# EasyEDA Pro project 视觉车.eprj, board 视觉车
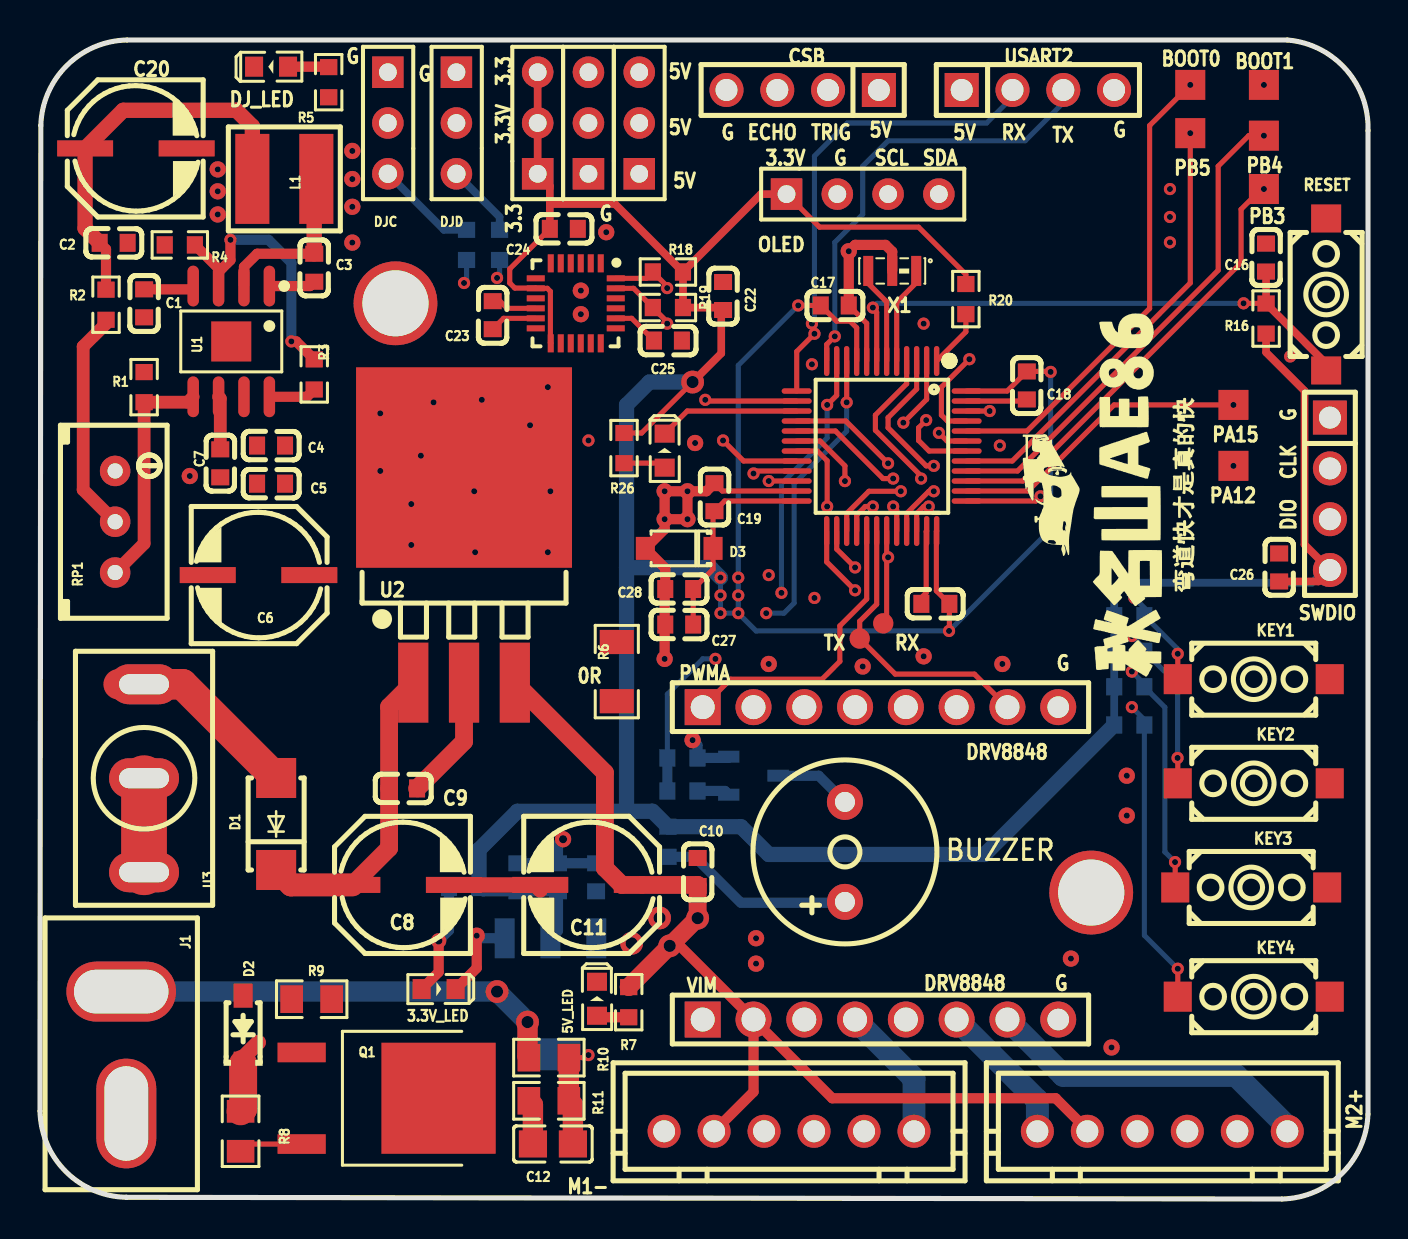
[diagram p1: board, top side]
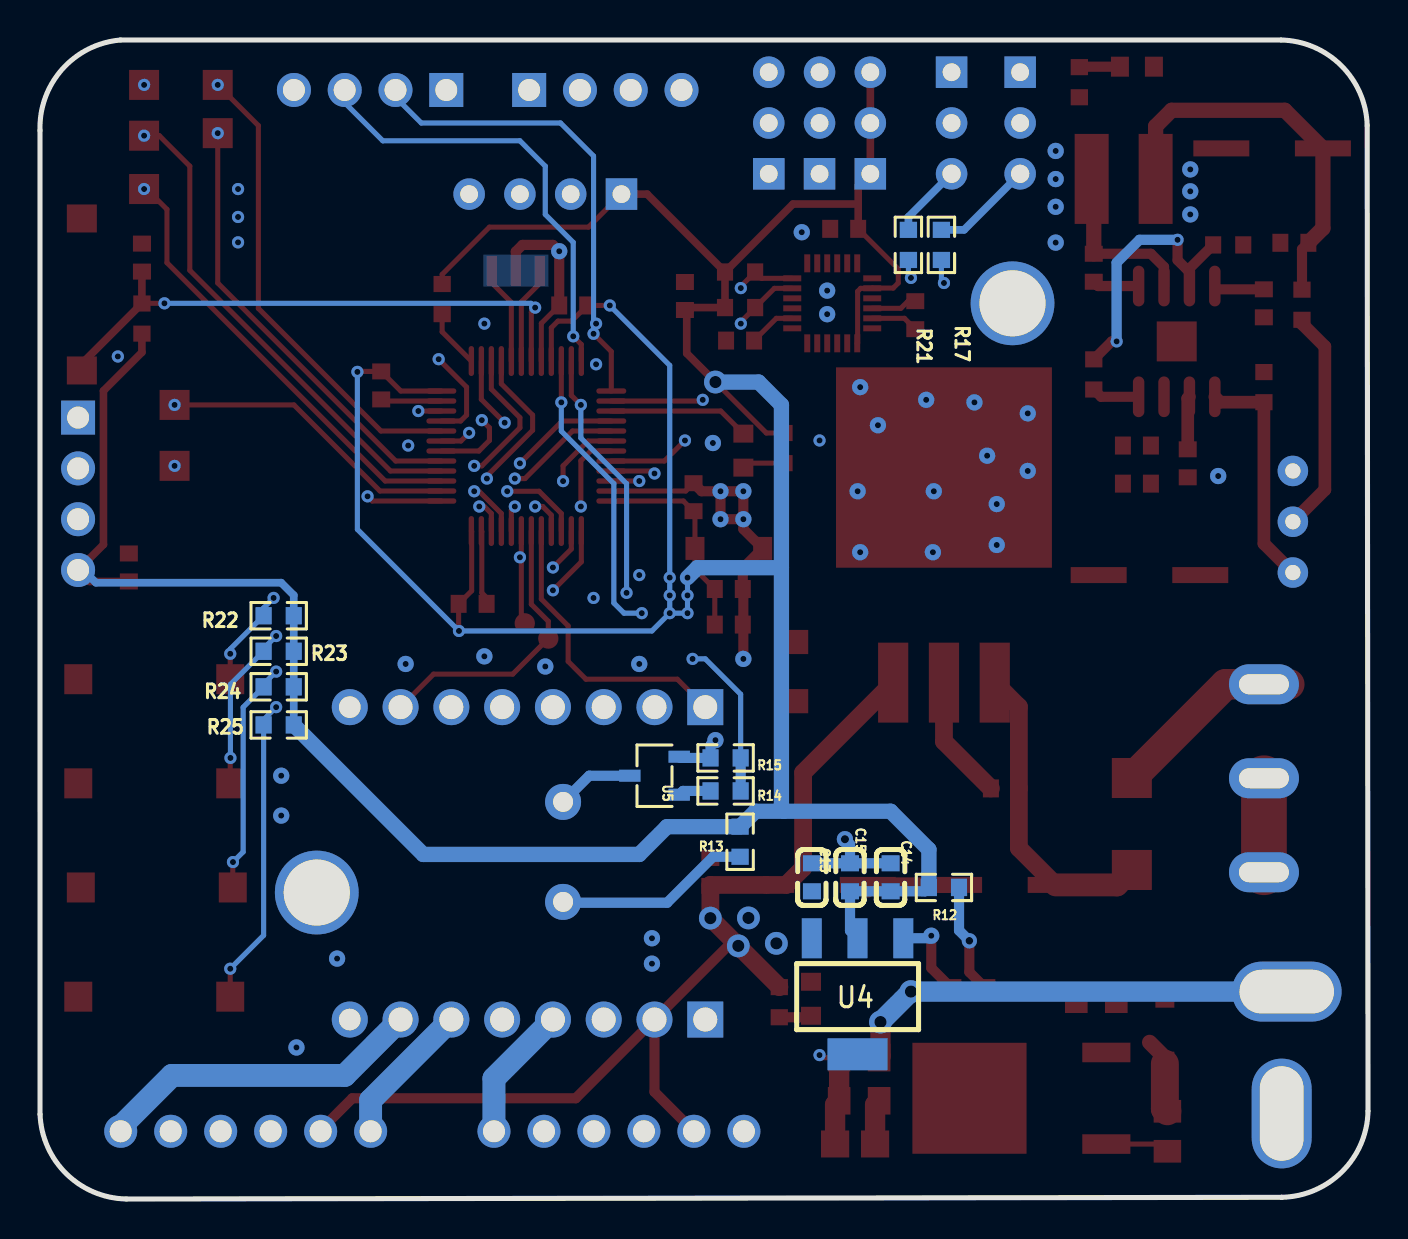
[diagram p2: board, bottom side, seen from below]

Outline 66.42 x 57.96 mm; copper layers: Top Layer, Inner1, Inner2, Bottom Layer. Coordinates in mm from the lower left corner of the outline.
Outline path: 0,4.4 0.04,53.68 arc(1.34,56.68) 4.36,57.96 62.4,57.95 arc(65.31,56.49) 66.42,53.42 66.42,4.23 arc(65.1,1.26) 62.11,0 4.32,0.08 arc(1.29,1.37) 0,4.4
Stack: Top Layer 0.035mm 外层铜厚1oz / Dielectric1 0.2104mm 7628 RC49% 8.6mil / Inner1 0.0152mm 内层铜厚 / Dielectric2 1.065mm 1.1mm H/HOZ 含铜 / Inner2 0.0152mm 内层铜厚 / Dielectric3 0.2104mm 7628 RC49% 8.6mil / Bottom Layer 0.035mm 外层铜厚1oz

## Design rules (mm)
spacing Default (default): track to track 0.025, other pairs 0 to 0.025
track width Default (default): min 0.254, default 0.254, max 25.4
differential pair differentialPair (default): width min 0.127, default 0.254, max 2.54; gap min 0.152, default 0.152
via Default (default): diameter min 0.61, default 0.61, max 100.025; hole min 0.305, default 0.305, max 59.995
net J1_2 uses gge15956
net U3_3 uses gge16139
net R9_1 uses gge16247
pour e1 uses gge16178
pour e38 uses gge15956
pour e39 uses gge15983
pour e864 uses gge16247

## Placement (name value [footprint] x y rotation side)
5V_LED  LED-0603_G  [LED0603_GREEN]  27.86 10.01 90 top
BUZZER  2700Hz  [BUZ-TH_BD9.0-P5.00-D0.6-FD]  40.26 17.36 90 top
C1  0.1u  [C0603]  5.21 44.79 90 top
C2  0.1u  [C0603]  3.68 47.81 180 top
C3  0.1u  [C0603]  13.72 46.57 90 top
C4  0.1u  [C0603]  11.56 37.68 180 top
C5  10u  [C0603]  11.56 35.77 180 top
C6  100u  [CAP-D6.3×H5.5]  8.39 31.2 0 top
C7  1u  [C0603]  9.02 36.79 270 top
C8  100u  [CAP-D6.3×H5.5]  20.7 15.71 180 top
C9  0.1u  [C0603]  18.16 20.53 180 top
C10  0.1u  [C0603]  32.89 16.35 270 top
C11  220uF  [CAP-D6.3×H5.5]  25.02 15.71 0 top
C12  0.1u  [C0805]  25.65 2.75 180 top
C13  10uF  [C0603_1]  27.81 16.09 90 bottom
C14  0.1u  [C0603_1]  23.88 16.09 90 bottom
C15  10uF  [C0603_1]  25.91 16.09 90 bottom
C16  1uF  [C0603]  61.32 47.07 270 top
C17  100nF  [C0603]  39.75 44.68 180 top
C18  100nF  [C0603]  49.35 40.68 90 top
C19  100nF  [C0603]  33.73 35.09 270 top
C20  220u  [CAP-D6.3×H5.5]  7.34 52.54 180 top
C21  100nF  [C0603]  44.78 29.76 0 top
C22  0.1u  [C0603]  34.16 45.15 90 top
C23  0.1u  [C0603]  22.64 44.2 90 top
C24  0.1u  [C0603]  26.2 48.51 180 top
C25  2200pF  [C0603]  31.41 42.93 180 top
C26  100nF  [C0603]  61.98 31.58 270 top
C27  10u  [C0603]  31.97 28.72 0 top
C28  10u  [C0603]  31.97 30.5 0 top
CSB  CSB  [HDR-TH_4P-P2.54-V-M]  38.15 55.46 180 top
D1  SS54_C2891720  [DO-214AC_L4.3-W2.7-LS5.2-RD]  11.81 18.75 90 top
D2  BZT52C16_C699213  [SOD-123_L2.7-W1.6-LS3.7-RD-1]  10.16 8.47 90 top
D3  MMSZ3V3CW  [SOD-123_L2.8-W1.8-LS3.7-RD]  31.97 32.53 180 top
DJC  HDR-F-2.54_1x3  [HDR-F-2.54_1X3]  17.4 53.81 270 top
DJD  HDR-F-2.54_1x3  [HDR-F-2.54_1X3]  20.83 53.81 270 top
J1  -  [T型插头]  4.06 10.37 270 top
J2  HDR-M-2.54_1x3  [HDR-M-2.54_1X3]  27.43 53.81 90 top
J3  HDR-M-2.54_1x3  [HDR-M-2.54_1X3]  24.89 53.81 90 top
J4  HDR-M-2.54_1x3  [HDR-M-2.54_1X3]  29.97 53.81 90 top
JP1  XH2.54-6P  [CONN-TH_XH2.54-6P]  37.47 3.39 180 top
JP2  XH2.54-6P  [CONN-TH_XH2.54-6P]  56.13 3.39 180 top
KEY1  K2-3.6×6.1_SMD  [KEY-SMD_2P-L6.2-W3.6-LS8.0]  60.71 25.99 0 top
KEY2  K2-3.6×6.1_SMD  [KEY-SMD_2P-L6.2-W3.6-LS8.0]  60.71 20.79 0 top
KEY3  K2-3.6×6.1_SMD  [KEY-SMD_2P-L6.2-W3.6-LS8.0]  60.58 15.58 0 top
KEY4  K2-3.6×6.1_SMD  [KEY-SMD_2P-L6.2-W3.6-LS8.0]  60.71 10.12 0 top
L1  4.7uH  [IND-SMD_L4.2-W4.2_GNR4018PM-4R7M]  12.22 51.01 0 top
LED1  LED-0603_R  [LED0603_RED]  11.56 56.62 180 top
LED3  LED-0603_G  [LED0603_GREEN]  31.24 37.42 90 top
LED4  LED-0603_B  [LED0603_BLUE]  19.94 10.5 0 top
NOREF  -  [Pad_ie37]  42.17 28.79 90 top
NOREF#2  -  [Pad_ie36]  41 28.02 90 top
NOREF#3  -  [Pad_ie1010]  52.58 15.32 180 top
NOREF#4  -  [Pad_ie1011]  17.78 44.79 180 top
OLED  HDR-F-2.54_1x4  [HDR-F-2.54_1X4]  41.15 50.25 0 top
Q1  VBE1302  [TO-252-2_L6.6-W6.1-P4.58-LS9.9-TL-1_1]  16.51 5.04 0 top
R1  100k  [R0603]  5.21 40.6 270 top
R2  100k  [R0603]  3.3 44.72 270 top
R3  10k  [R0603]  13.72 41.23 90 top
R4  10k  [R0603]  6.99 47.71 0 top
R5  10k  [R0603]  14.44 55.85 270 top
R6  1k  [R1206]  28.85 26.37 270 top
R7  4.7k  [R0603]  29.44 9.84 90 top
R8  4.7k  [R0805]  10.03 3.39 90 top
R9  1k  [R0805]  13.59 9.99 180 top
R10  200k  [R0805]  25.45 7.07 0 top
R11  100k  [R0805]  25.45 4.91 180 top
R12  1k  [R0603_1]  21.21 15.58 0 bottom
R13  10R  [R0603_1]  31.41 17.86 270 bottom
R14  4.7k  [R0603_1]  32.13 20.4 0 bottom
R15  10k  [R0603_1]  32.13 22.06 0 bottom
R16  10k  [R0603]  61.32 44.03 90 top
R17  1k  [R0603_1]  21.34 47.71 90 bottom
R18  4.7k  [R0603]  31.41 46.35 0 top
R19  4.7k  [R0603]  31.41 44.58 0 top
R20  1k  [R0603]  46.31 45 270 top
R21  1k  [R0603_1]  22.99 47.71 90 bottom
R22  1k  [R0603_1]  54.48 29.17 0 bottom
R23  1k  [R0603_1]  54.48 27.39 0 bottom
R24  1k  [R0603_1]  54.48 25.61 0 bottom
R25  1k  [R0603_1]  54.48 23.71 0 bottom
R26  1K  [R0603]  29.21 37.55 90 top
RESET  K2-3.6×6.1_SMD  [KEY-SMD_2P-L6.2-W3.6-LS8.0]  64.33 45.23 270 top
RP1  R_3296W_US  [RES-ADJ-TH_3296W]  3.76 33.87 0 top
SWDIO  CSB  [HDR-TH_4P-P2.54-V-M]  64.52 35.26 270 top
TB661FNG1  TB661FNG1  [HDR-TH_8P-P2.54-V-F-1]  42.04 24.6 0 top
TB661FNG2  TB661FNG2  [HDR-TH_8P-P2.54-V-F-1]  42.04 8.97 0 top
U1  SY8205FCC  [SOIC-8_L5.0-W4.0-P1.27-LS6.0-BL-EP2.0]  9.57 42.88 180 top
U2  SPX2940-5.0  [TO-263-3_L10.2-W9.0-P2.54-LS15.2-TL]  21.21 31.2 90 top
U3  7101J52ZQE11  [SW-TH_3P-L12.7-W6.8-P4.70]  5.2 21.04 270 top
U4  AMS117  [AMS117-3.3]  23.24 13.04 0 bottom
U5  S8050_C7603172  [SOT-23-3_L2.9-W1.6-P1.90-LS2.8-BR]  35.69 21.17 180 bottom
U6  小焊盘  [焊盘]  61.21 53.17 0 top
U8  MPU6050  [QFN-24_L4.0-W4.0-P0.50-BL]  26.8 44.79 180 top
U9  STM32F103C8T6  [LQFP-48_L7.0-W7.0-P0.50-LS9.0-BL]  42.1 37.65 180 top
U10  小焊盘  [焊盘]  57.53 53.3 0 top
U11  小焊盘  [焊盘]  59.69 36.66 0 top
U12  小焊盘  [焊盘]  59.69 39.71 0 top
U13  小焊盘  [焊盘]  61.21 50.5 0 top
U16  小焊盘  [焊盘]  57.53 55.71 0 top
U17  小焊盘  [焊盘]  61.21 55.71 0 top
USART2  CSB  [HDR-TH_4P-P2.54-V-M]  49.91 55.46 0 top
X1  CSTCE8M00G55Z-R0  [OSC-SMD_3P-L3.2-W1.3-P1.20]  42.62 46.41 180 top

## Footprints (pads in the part's own frame, mm; a bottom-side part is the same pattern mirrored in y, then rotated)
AMS117-3.3
  custom 1x2 smd: 1(0,0) 2(2.29,0) 3(4.58,0)
  rect 3x1.6 smd: 4(2.29,5.8)
BUZ-TH_BD9.0-P5.00-D0.6-FD
  round 1.8 hole 1: 1(-2.5,0) 2(2.5,0)
C0603
  rect 0.8x0.9 smd: 1(-0.7,0) 2(0.7,0)
C0603_1
  rect 0.8x0.9 smd: 1(-0.7,0) 2(0.7,0)
C0805
  rect 1.41x1.35 smd: 1(-1,0) 2(1,0)
CAP-D6.3×H5.5
  rect 2.8x0.8 smd: 1(5.08,0) 2(0,0)
CONN-TH_XH2.54-6P
  round 1.65 hole 1.1: 1(-6.25,0) 2(-3.75,0) 3(-1.25,0) 4(1.25,0) 5(3.75,0) 6(6.25,0)
DO-214AC_L4.3-W2.7-LS5.2-RD
  rect 2x2 smd: 1(-2.3,0) 2(2.3,0)
HDR-F-2.54_1X3
  rect 1.575x1.575 hole 0.889: 1(-2.54,0)
  round 1.575 hole 0.889: 2(0,0)
  round 1.575 hole 0.914: 3(2.54,0)
HDR-F-2.54_1X4
  rect 1.575x1.575 hole 0.889: 1(-3.81,0)
  round 1.575 hole 0.889: 2(-1.27,0) 3(1.27,0) 4(3.81,0)
HDR-M-2.54_1X3
  rect 1.575x1.575 hole 0.889: 1(-2.54,0)
  round 1.575 hole 0.889: 2(0,0) 3(2.54,0)
HDR-TH_4P-P2.54-V-M
  rect 1.7x1.7 hole 1.1: 1(-3.81,0)
  round 1.7 hole 1.1: 2(-1.27,0) 3(1.27,0) 4(3.81,0)
HDR-TH_8P-P2.54-V-F-1
  rect 1.8x1.8 hole 1.2: 1(-8.89,0)
  round 1.8 hole 1.2: 2(-6.35,0) 3(-3.81,0) 4(-1.27,0) 5(1.27,0) 6(3.81,0) 7(6.35,0)
  round 1.8 hole 1.082: 8(8.89,0)
IND-SMD_L4.2-W4.2_GNR4018PM-4R7M
  rect 1.7x4.5 smd: 1(-1.6,0) 2(1.6,0)
KEY-SMD_2P-L6.2-W3.6-LS8.0
  rect 1.4x1.5 smd: 1(-3.8,0) 2(3.8,0)
LED0603_BLUE
  rect 0.9x1 smd: 1(-0.85,0) 2(0.85,0)
LED0603_GREEN
  rect 0.9x1 smd: 1(-0.85,0) 2(0.85,0)
LED0603_RED
  rect 0.9x1 smd: 1(-0.85,0) 2(0.85,0)
LQFP-48_L7.0-W7.0-P0.50-LS9.0-BL
  oval 0.27x1.5 smd: 1(-2.75,-4.25) 2(-2.25,-4.25) 3(-1.75,-4.25) 4(-1.25,-4.25) 5(-0.75,-4.25) 6(-0.25,-4.25) 7(0.25,-4.25) 8(0.75,-4.25) 9(1.25,-4.25) 10(1.75,-4.25) 11(2.25,-4.25) 12(2.75,-4.25) 25(2.75,4.25) 26(2.25,4.25) 27(1.75,4.25) 28(1.25,4.25) 29(0.75,4.25) 30(0.25,4.25) 31(-0.25,4.25) 32(-0.75,4.25) 33(-1.25,4.25) 34(-1.75,4.25) 35(-2.25,4.25) 36(-2.75,4.25)
  oval 1.5x0.27 smd: 13(4.25,-2.75) 14(4.25,-2.25) 15(4.25,-1.75) 16(4.25,-1.25) 17(4.25,-0.75) 18(4.25,-0.25) 19(4.25,0.25) 20(4.25,0.75) 21(4.25,1.25) 22(4.25,1.75) 23(4.25,2.25) 24(4.25,2.75) 37(-4.25,2.75) 38(-4.25,2.25) 39(-4.25,1.75) 40(-4.25,1.25) 41(-4.25,0.75) 42(-4.25,0.25) 43(-4.25,-0.25) 44(-4.25,-0.75) 45(-4.25,-1.25) 46(-4.25,-1.75) 47(-4.25,-2.25) 48(-4.25,-2.75)
OSC-SMD_3P-L3.2-W1.3-P1.20
  rect 0.5x1.5 smd: 1(-1.2,0) 2(0,0) 3(1.2,0)
Pad_ie36
  round 1.016 smd: (0,0)
Pad_ie37
  round 1.016 smd: (0,0)
Pad_ie1010
  round 4.191 hole 3.307x3.302: 1(0,0)
Pad_ie1011
  round 4.191 hole 3.307x3.302: 1(0,0)
QFN-24_L4.0-W4.0-P0.50-BL
  rect 0.3x0.9 smd: 1(-1.25,-2) 2(-0.75,-2) 3(-0.25,-2) 4(0.25,-2) 5(0.75,-2) 6(1.25,-2) 13(1.25,2) 14(0.75,2) 15(0.25,2) 16(-0.25,2) 17(-0.75,2) 18(-1.25,2)
  rect 0.9x0.3 smd: 7(2,-1.25) 8(2,-0.75) 9(2,-0.25) 10(2,0.25) 11(2,0.75) 12(2,1.25) 19(-2,1.25) 20(-2,0.75) 21(-2,0.25) 22(-2,-0.25) 23(-2,-0.75) 24(-2,-1.25)
R0603
  rect 0.806x0.864 smd: 1(-0.753,0) 2(0.753,0)
R0603_1
  rect 0.806x0.864 smd: 1(-0.753,0) 2(0.753,0)
R0805
  rect 1.133x1.377 smd: 1(-1,0) 2(1,0)
R1206
  rect 1.208x1.701 smd: 1(-1.479,0) 2(1.479,0)
RES-ADJ-TH_3296W
  round 1.524 hole 0.762: 1(0.001,2.54) 2(0.001,0) 3(0.001,-2.54)
SOD-123_L2.7-W1.6-LS3.7-RD-1
  rect 1.2x0.95 smd: 1(-1.7,0) 2(1.7,0)
SOD-123_L2.8-W1.8-LS3.7-RD
  rect 0.95x1.15 smd: 1(-1.692,0) 2(1.692,0)
SOIC-8_L5.0-W4.0-P1.27-LS6.0-BL-EP2.0
  oval 0.574x2.038 smd: 1(-1.905,-2.769) 2(-0.635,-2.769) 3(0.635,-2.769) 4(1.905,-2.769) 5(1.905,2.769) 6(0.635,2.769) 7(-0.635,2.769) 8(-1.905,2.769)
  rect 2x2 smd: 9(0,0)
SOT-23-3_L2.9-W1.6-P1.90-LS2.8-BR
  rect 1.07x0.6 smd: 1(1.235,-0.95) 2(1.235,0.95) 3(-1.235,0)
SW-TH_3P-L12.7-W6.8-P4.70
  oval 2x3.5 hole 1x2.5: 1(-4.7,0) 2(0,0) 3(4.7,0)
TO-252-2_L6.6-W6.1-P4.58-LS9.9-TL-1_1
  rect 2.409x0.979 smd: 1(-3.424,2.29) 3(-3.423,-2.29)
  rect 5.711x5.548 smd: 4(3.424,0)
TO-263-3_L10.2-W9.0-P2.54-LS15.2-TL
  rect 4x1.511 smd: 1(-5.378,2.54) 2(-5.378,0) 3(-5.378,-2.54)
  rect 10.02x10.8 smd: 4(5.378,0)
T型插头
  oval 2.997x5.486 hole 2.184x4.724: 1(0,0)
  oval 5.486x2.997 hole 4.724x2.184: 2(6.096,0.254)
焊盘
  rect 1.5x1.5 smd: 1(0,0)

## Nets
3.3V: C14.1 C15.1 C17.2 C18.2 C19.2 C21.2 C22.1 C24.2 C26.2 C27.2 C28.2 D3.1 J3.1 J3.2 J3.3 OLED.1 R12.2 R13.1 R16.1 R18.2 R19.2 R20.1 R22.1 R23.1 R24.1 R25.1 R26.2 SWDIO.4 U4.2 U8.8 U8.13 U9.9 U9.24 U9.36 U9.48
5V: C10.2 C11.1 C13.1 CSB.1 J4.1 J4.2 J4.3 JP1.5 JP2.5 R7.2 TB661FNG2.2 U2.3 U4.3 USART2.1
GND5V: C13.2 C14.2 C15.2 C16.1 C17.1 C18.1 C19.1 C21.1 C22.2 C23.1 C24.1 C25.1 C26.1 C27.1 C28.1 CSB.4 D3.2 J2.1 J2.2 J2.3 KEY1.2 KEY2.2 KEY3.2 KEY4.2 LED4.2 OLED.2 R6.1 R15.2 RESET.1 SWDIO.1 U4.1 U5.2 U8.1 U8.11 U8.18 U9.8 U9.23 U9.35 U9.47 USART2.4 X1.2
GNDVIN: 5V_LED.2 C1.1 C2.1 C4.2 C5.2 C6.2 C7.2 C8.2 C9.1 C10.1 C11.2 C12.2 C20.2 DJC.1 DJD.1 JP1.2 JP2.2 LED1.2 Q1.4 R1.1 R4.1 R6.2 R11.2 TB661FNG1.8 TB661FNG2.3 TB661FNG2.8 U1.9 U2.2 U2.4
VIN: C4.1 C5.1 C6.1 D1.2 J1.1 R3.1 R10.1 TB661FNG2.1 U1.7 U1.8 U3.1
ADC: C12.1 R10.2 R11.1 U9.14
AIN1: TB661FNG1.3 U9.18
AIN2: TB661FNG1.2 U9.19
BIN1: TB661FNG1.5 U9.25
BIN2: TB661FNG1.6 U9.26
BOOT0: U9.44 U16.1
BOOT1: U9.20 U17.1
BUZZER: R14.1 R15.1 U9.2
BUZZER3_1: BUZZER.1 R13.2
BUZZER3_2: BUZZER.2 U5.3
C23_2: C23.2 U8.10
C25_2: C25.2 U8.20
ECHO: CSB.3 U9.42
ENC1_A: JP1.4 U9.10
ENC1_B: JP1.3 U9.11
ENC2_A: JP2.4 U9.16
ENC2_B: JP2.3 U9.17
H1_3: DJC.3 R17.2
H2_3: DJD.3 R21.2
J1_2: D2.2 J1.2 Q1.3 R8.1
LED3_1: LED3.1 R26.1
M1+: JP1.1 TB661FNG2.4
M1-: JP1.6 TB661FNG2.5
M2+: JP2.1 TB661FNG2.7
M2-: JP2.6 TB661FNG2.6
MPU_SCL: R19.1 U8.23 U9.21
MPU_SDA: R18.1 U8.24 U9.22
OLED_SCL: OLED.3 U9.45
OLED_SDA: OLED.4 U9.46
PA5: LED3.2 U9.15
PA12: U9.33 U11.1
PA15: U9.38 U12.1
PB3: U9.39 U13.1
PB4: U6.1 U9.40
PB5: U9.41 U10.1
PB14: KEY3.1 R24.2 U9.27
PB15: KEY4.1 R25.2 U9.28
PC14: KEY1.1 R22.2 U9.3
PC15: KEY2.1 R23.2 U9.4
PWMA: TB661FNG1.1 U9.29
PWMB: NOREF#2. TB661FNG1.7 U9.30
PWMC: NOREF. R17.1 U9.31
PWMD: R21.1 U9.32
R2_2: R2.2 RP1.2
R5_1: LED1.1 R5.1
R7_1: 5V_LED.1 R7.1
R9_1: Q1.1 R9.1
R12_1: LED4.1 R12.1
RESET: C16.2 R16.2 RESET.2 U9.7
SERVO_VCC: C2.2 C20.1 DJC.2 DJD.2 L1.1 R2.1 R5.2
SWCLK: SWDIO.2 U9.37
SWDIO: SWDIO.3 U9.34
TB661FNG1_4: TB661FNG1.4
TRIG: CSB.2 U9.43
U1_1: C3.1 U1.1
U1_2: C3.2 L1.2 U1.2
U1_3: R3.2 R4.2 U1.3
U1_4: C1.2 U1.4
U1_5: R1.2 RP1.3 U1.5
U1_6: C7.1 U1.6
U2_1: C8.1 C9.2 D1.1 U2.1
U3_3: D2.1 R8.2 R9.2 U3.2 U3.3
U5_1: R14.2 U5.1
U7_1: U9.5 X1.1
U7_3: U9.6 X1.3
U8_2: U8.2
U8_3: U8.3
U8_4: U8.4
U8_5: U8.5
U8_6: U8.6
U8_7: U8.7
U8_9: U8.9
U8_12: U8.12
U8_14: U8.14
U8_15: U8.15
U8_16: U8.16
U8_17: U8.17
U8_19: U8.19
U8_21: U8.21
U8_22: U8.22
U9_1: R20.2 U9.1
USART2_RX: U9.13 USART2.2
USART2_TX: U9.12 USART2.3

Pads without a net: NOREF#3 1; NOREF#4 1; RP1 1; U4 4

## Via types
v1: diameter 1.143, hole 0.61, Top Layer to Bottom Layer, 7 vias
v2: diameter 0.813, hole 0.305, Top Layer to Bottom Layer, 43 vias
v3: diameter 0.61, hole 0.305, Top Layer to Bottom Layer, 75 vias
v4: diameter 0.813, hole 0.406, Top Layer to Bottom Layer, 1 via
v5: diameter 0.762, hole 0.381, Top Layer to Bottom Layer, 1 via

## Routing (per net, layer and track width the routed paths; a pad name or vN(x,y) marks a point on that pad's centre or on a via; arc(x,y) is an arc through that point)
3.3V: length 232.8
  Top Layer w0.254: v3(37.92,44.68) C17.2 39.83,43.9 40.51,43.9 40.85,43.57 U9.9 ; U8.13 25.53,42.81 25.53,45.39 25.37,45.54 U8.8 24.78,45.55 23.75,45.55 23.5,45.8 23.5,46.51 C24.2 ; U9.24 34.24,34.9 C19.2 33.66,34.32 D3.1 33.66,31.49 C28.2 C27.2 ; OLED.1 38.99,48.6 43.94,48.6 46.31,46.23 46.31,45.75 ; v3(50.55,41.36) 50.52,41.38 C18.2 48.38,40.4 46.35,40.4 ; R26.2 30.09,38.3 v1(32.64,40.85) ; v3(45.47,28.41) 45.48,28.42 45.48,29.76 44.83,30.41 44.83,33.39 44.85,33.4
  Top Layer w0.381: C24.2 25.5,49.75 ; 25.5,49.75 28.76,49.75 R18.2 ; 25.5,49.75 25.5,50.66 J3.1 J3.2 24.89,56.35 ; R16.1 61.32,42.34 63.25,40.41 63.25,32.72 SWDIO.4 63.94,30.88 C26.2 ; R18.2 36.05,50.25 OLED.1 ; R18.2 R19.2 33.88,44.58 34.07,44.39 34.07,42.29 v1(32.64,40.85)
  Bottom Layer w0.254: v3(50.55,41.36) 50.55,33.49 v3(45.47,28.41) 35.81,28.41 v3(34.92,29.29) ; v3(34.92,29.29) v3(34.04,29.29) v3(34.04,30.18) v3(34.04,31.07) ; v3(34.92,29.29) v3(34.92,30.18) v3(34.92,31.07) 34.92,41.69 v3(37.92,44.68)
  Bottom Layer w0.381: R25.1 R24.1 R23.1 R22.1 53.73,30.19 54.36,30.82 63.63,30.82 64.26,31.45 SWDIO.4
  Bottom Layer w0.508: R12.2 22.15,15.39 C14.1 C15.1 25.91,13.42 25.53,13.04
  Bottom Layer w0.762: R12.2 21.96,17.48 23.88,19.39 29.21,19.39 ; v1(32.64,40.85) 30.48,40.85 29.34,39.71 29.34,31.57 ; R25.1 47.25,17.23 36.45,17.23 35.06,18.62 R13.1 30.64,19.39 29.21,19.39 ; 29.21,19.39 29.34,19.52 29.34,31.57 ; 29.34,31.57 33.54,31.57 v3(34.04,31.07)
5V: length 114.7
  Top Layer w0.508: TB661FNG2.2 39.62,5.04 50.8,5.04 52.38,3.45 JP2.5 ; TB661FNG2.2 35.69,5.36 JP1.5 ; TB661FNG2.2 32,12.66 v1(31.5,12.66)
  Top Layer w0.889: U2.3 28.25,21.32 28.25,16.55 29.1,15.71 C11.1 32.89,15.71 v1(32.89,14.04) 32.88,14.04 v1(31.5,12.66) 29.44,10.61 R7.2
  Inner1 w1.016: USART2.1 CSB.1 40.3,57.11 30.73,57.11 29.97,56.35 J4.2 J4.1 29.97,15.2 29.59,14.82 v1(29.59,12.78)
  vias: v1(30.99,14.05)
GND5V: length 69.7
  Top Layer w0.254: U9.23 34.13,35.4 C19.1 ; C17.1 41.35,43.79 41.35,41.9 ; C18.1 49.28,39.9 46.35,39.9 ; U8.11 23.19,44.04 C23.1 ; 44.35,33.4 44.32,33.38 44.32,30.31 44.08,30.07 C21.1
  Top Layer w0.508: v2(31.24,27.01) 31.24,28.7 ; 31.24,28.7 31.24,30.47 C28.1 31.27,31.54 D3.2 31.24,33.5 v2(31.24,33.99) ; 31.24,28.7 C27.1 ; v2(32.38,35.39) v2(32.38,33.99) v2(31.24,33.99) ; v2(32.38,35.39) v2(31.24,35.39) v2(31.24,33.99) ; v2(32.38,35.39) 33.33,35.39 C19.1 ; X1.2 42.62,47.38 42.29,47.71 40.77,47.71 v2(40.45,47.39) C17.1 ; v2(21.84,13.17) 21.84,11.55 LED4.2
  Inner2 w0.508: v2(21.84,13.17) 21.84,13.67 v4(26.16,17.99) 27.69,17.99 v2(32.64,22.94) 31.98,22.94 31.24,23.68 v2(31.24,27.01)
  Bottom Layer w0.508: C15.2 C13.2 ; C15.2 C14.2 ; C15.2 25.91,17.74 v4(26.16,17.99) ; v2(32.64,22.94) 32.88,22.7 R15.2 34.39,22.06 U5.2 ; v2(21.84,13.17) 21.97,13.04 U4.1
  vias: v2(27.05,45.42) v2(27.05,44.25) v2(28.32,48.34) v2(32.77,37.8) v2(36.45,26.75) v2(41.15,26.63) v2(44.2,27.14) v2(48.13,26.75) v2(53.59,7.58) v2(54.36,21.17) v2(54.36,19.17) v3(36.45,31.2) v3(38.61,41.74) v3(38.73,30.06) v3(44.2,43.77) v3(48.01,37.68) v3(56.51,50.5) v3(56.51,49.11) v3(56.51,47.84) v3(62.53,42.13)
GNDVIN: length 12.9
  Top Layer w0.762: 25.02,15.45 24.76,15.71 C8.2
  Top Layer w0.889: C9.1 21.21,22.88 U2.2
  Top Layer w1.016: R11.2 24.65,4.71 C12.2
  vias: v2(7.49,36.15) v2(8.89,51.49) v2(8.89,50.39) v2(8.89,49.23) v2(15.62,52.41) v2(15.62,51) v2(15.62,49.62) v2(15.62,47.83) v2(17.02,39.29) v2(17.02,36.41) v2(18.57,34.75) v2(18.57,32.7) v2(19.05,37.17) v2(19.69,39.84) v2(21.72,35.39) v2(21.76,32.34) v2(22.1,39.96) v2(24.51,38.69) v2(25.4,40.6) v2(25.4,32.34) v2(25.53,35.39) v2(35.81,13.04) v2(35.81,11.77) v2(51.56,12.02)
VIN: length 35
  Top Layer w0.508: U1.8 13.35,40.11 R3.1
  Top Layer w1.016: v1(24.38,8.85) 24.38,7.14 R10.1
  Top Layer w1.524: D1.2 7.12,25.74 U3.1 3.94,25.74
  Bottom Layer w1.016: J1.1 v1(22.86,10.37) v1(24.38,8.85)
ADC: length 47.5
  Top Layer w0.254: U9.14 33.33,39.9 v3(33.27,39.96) ; R10.2 27.31,7.07 v3(27.43,7.2)
  Top Layer w1.016: R10.2 R11.1 26.65,4.71 C12.1
  Inner1 w0.254: v3(27.43,7.2) v3(27.43,37.93)
  Inner2 w0.254: v3(27.43,37.93) 29.46,39.96 v3(33.27,39.96)
AIN1: length 15.8
  Top Layer w0.254: U9.18 39.02,37.9 40.26,36.66 v3(40.26,35.9)
  Inner1 w0.254: TB661FNG1.3 40.26,26.63 v3(40.26,35.9)
AIN2: length 16.4
  Top Layer w0.254: v3(39.37,34.63) 39.37,36.91 38.88,37.4 U9.19
  Inner1 w0.254: v3(39.37,34.63) 39.37,26.88 38.86,26.37 37.47,26.37 TB661FNG1.2
BIN1: length 10.4
  Top Layer w0.254: v3(40.77,30.44) 39.35,31.86 39.35,33.4
  Inner1 w0.254: TB661FNG1.5 43.31,27.9 v3(40.77,30.44)
BIN2: length 11.3
  Top Layer w0.254: U9.26 39.85,32.5 v3(40.77,31.58)
  Inner1 w0.254: TB661FNG1.6 45.85,26.5 v3(40.77,31.58)
BOOT0: length 23.7
  Top Layer w0.254: 46.35,38.4 49.37,38.4 55.5,44.53 55.5,53.68 v3(57.53,55.71)
BOOT1: length 45.4
  Top Layer w0.254: v3(34.16,37.93) 35.19,36.9 U9.20
  Inner2 w0.254: v3(34.16,37.93) 34.16,49.74 36.58,52.15 53.34,52.15 55.63,54.44 59.94,54.44 v3(61.21,55.71)
BUZZER: length 29.1
  Top Layer w0.254: v3(43.18,38.82) 44.35,39.99 44.35,41.9
  Inner1 w0.254: v3(43.18,38.82) 41.15,38.82 35.69,33.36 35.69,27.77 34.92,27.01 v3(33.78,27.01)
  Bottom Layer w0.254: v3(33.78,27.01) 33.15,27.01 31.38,25.24 R15.1
  Bottom Layer w0.508: R14.1 R15.1
BUZZER3_1: length 9.8
  Bottom Layer w0.508: R13.2 32.76,17.11 35.05,14.82 40.22,14.82 BUZZER.1
BUZZER3_2: length 3.9
  Bottom Layer w0.508: U5.3 38.95,21.17 BUZZER.2
C23_2: length 2.3
  Top Layer w0.254: U8.10 23.36,44.54 23.01,44.9 C23.2
C25_2: length 2.4
  Top Layer w0.254: U8.20 29.59,44.04 C25.2
ECHO: length 26.8
  Top Layer w0.254: 46.35,37.4 44.47,37.4 43.94,37.93 43.94,38.57 v3(44.32,38.95)
  Inner1 w0.254: CSB.3 38.73,53.6 38.73,49.23 39.75,48.22 44.11,48.22 45.34,46.99 45.34,39.96 v3(44.32,38.95)
ENC1_A: length 42.2
  Top Layer w0.254: 40.35,41.9 v3(40.35,39.84)
  Inner2 w0.254: v3(36.32,29.29) 36.32,27.64 34.42,25.74 34.42,5.18 JP1.4
  Bottom Layer w0.254: v3(36.32,29.29) 37.21,29.29 37.72,29.8 37.72,35.77 40.35,38.4 v3(40.35,39.84)
ENC1_B: length 40.3
  Top Layer w0.254: U9.11 39.85,40.19 v3(39.37,39.71)
  Inner2 w0.254: v3(37.08,30.31) 37.08,5.02 JP1.3
  Bottom Layer w0.254: v3(37.08,30.31) 37.08,35.77 39.37,38.06 v3(39.37,39.71)
ENC2_A: length 44.8
  Top Layer w0.254: U9.16 40.3,38.9 v3(42.42,36.79)
  Inner1 w0.254: v3(42.42,36.79) 42.16,36.53 42.16,33.36 47.12,28.41 47.12,13.29 49.66,10.75 49.66,7.7 53.97,3.39 JP2.4
ENC2_B: length 44.8
  Top Layer w0.254: U9.17 39.79,38.4 42.16,36.03 v3(42.67,36.03)
  Inner1 w0.254: v3(42.67,36.03) 42.8,35.9 43.31,35.9 43.81,35.39 43.81,32.34 49.66,26.5 49.66,12.53 57.38,4.8 JP2.3
H1_3: length 5.1
  Bottom Layer w0.381: R17.2 20.2,48.46 DJC.3
H2_3: length 3.7
  Bottom Layer w0.381: DJD.3 22.99,49.11 R21.2
J1_2: length 3.2
  Top Layer w0.254: R8.1 10.39,2.75 Q1.3
LED3_1: length 2.1
  Top Layer w0.254: R26.1 31.02,36.8 LED3.1
M1+: length 6.8
  Bottom Layer w1.143: JP1.1 43.72,6.03 TB661FNG2.4
M1-: length 14.5
  Inner1 w1.143: TB661FNG2.5 39.88,5.55 33.27,5.55 31.22,3.49 JP1.6
M2+: length 16.4
  Bottom Layer w1.143: JP2.1 62.38,3.61 59.82,6.18 51.18,6.18 TB661FNG2.7
M2-: length 7.3
  Bottom Layer w1.143: JP2.6 49.88,4.94 TB661FNG2.6
MPU_SCL: length 14.8
  Top Layer w0.254: v3(35.69,36.28) 35.81,36.4 U9.21 ; v3(31.37,43.77) 31.37,43.86 R19.1 29.69,45.54 U8.23
  Inner1 w0.254: v3(31.37,43.77) 35.69,39.45 v3(35.69,36.28)
MPU_SDA: length 16.2
  Top Layer w0.254: U8.24 30.34,46.04 R18.1 31.37,45.64 v3(31.37,45.55) ; U9.22 v3(36.45,35.9)
  Inner1 w0.254: v3(36.45,35.9) 36.45,40.47 v3(31.37,45.55)
OLED_SCL: length 15.4
  Top Layer w0.254: 46.35,38.9 45.38,38.9 45.09,39.2 45.09,40.6 v3(46.48,41.99)
  Inner2 w0.254: v3(46.48,41.99) 46.48,47.46 44.83,49.11 43.56,49.11 OLED.3
OLED_SDA: length 13.1
  Top Layer w0.254: 46.35,39.4 v3(47.5,39.4)
  Inner1 w0.254: v3(47.5,39.4) 47.5,47.71 OLED.4
  Bottom Layer w0.254: v3(47.5,39.4) 47.5,39.45
PA5: length 7.1
  Top Layer w0.254: LED3.2 32.37,39.4 U9.15
PA12: length 18.2
  Top Layer w0.254: 43.35,33.4 43.35,34.28 44.46,35.39 v3(44.7,35.39)
  Inner1 w0.254: v3(44.7,35.39) 45.09,35.77 58.8,35.77 v3(59.69,36.66)
PA15: length 15.1
  Top Layer w0.254: v3(59.69,39.71) 53.72,39.71 49.41,35.4 46.35,35.4
PB3: length 22.5
  Top Layer w0.254: v3(61.21,50.5) 61.09,50.5 60.07,49.49 60.07,46.82 49.15,35.9 46.35,35.9
PB4: length 24.9
  Top Layer w0.254: v3(61.21,53.17) 60.45,53.17 58.93,51.65 58.93,46.44 48.89,36.4 46.35,36.4
PB5: length 22.5
  Top Layer w0.254: 46.35,36.9 48.63,36.9 57.53,45.8 v3(57.53,53.3) 57.4,53.3
PB14: length 31.4
  Top Layer w0.254: KEY3.1 56.78,16.84 v3(56.77,16.85) ; 40.35,33.4 40.35,34.28 41.46,35.39 v3(43.05,35.39)
  Inner2 w0.254: v3(54.61,26.37) 54.36,26.63 51.38,26.63 43.43,34.58 43.43,35.01 v3(43.05,35.39)
  Bottom Layer w0.254: v3(56.77,16.85) 56.26,17.36 56.26,24.59 R24.2 55.24,25.75 v3(54.61,26.37) ; v3(43.05,35.39) 43.05,35.26
PB15: length 34.5
  Top Layer w0.254: U9.28 40.85,34.2 41.28,34.63 v3(41.66,34.63) ; KEY4.1 v3(56.91,11.51)
  Inner2 w0.254: v3(41.66,34.63) 42.29,33.99 43.31,33.99 51.18,26.12 53.09,26.12 v3(54.61,24.6)
  Bottom Layer w0.254: 56.91,11.64 v3(56.91,11.51) 55.24,13.18 R25.2 55.24,23.97 v3(54.61,24.6)
PC14: length 24.7
  Top Layer w0.254: v3(44.7,36.66) 44.32,36.66 42.42,38.57 42.42,39.07 43.85,40.5 43.85,41.9 ; KEY1.1 v3(56.91,27.26)
  Inner2 w0.254: v3(54.74,30.06) 53.59,30.06 46.99,36.66 v3(44.7,36.66)
  Bottom Layer w0.254: v3(56.91,27.26) 56.91,27.5 R22.2 55.24,29.56 v3(54.74,30.06)
PC15: length 29.6
  Top Layer w0.254: 43.35,41.9 43.35,40.76 41.78,39.2 41.78,38.44 44.07,36.15 v3(44.07,36.03) ; KEY2.1 56.91,22.05 v3(56.9,22.06)
  Inner2 w0.254: v3(54.61,28.15) 46.74,36.03 v3(44.07,36.03)
  Bottom Layer w0.254: v3(54.61,28.15) 55.24,27.53 R23.2 56.9,25.73 v3(56.9,22.06)
PWMA: length 14.9
  Top Layer w0.254: 41.35,33.4 41.35,30 40,28.66 40,26.88 39.12,25.99 34.54,25.99 TB661FNG1.1
PWMB: length 14.5
  Top Layer w0.254: U9.30 41.85,29.74 41,28.89 41,28.02 42.78,26.25 46.74,26.25 TB661FNG1.7
PWMC: length 37.5
  Top Layer w0.254: 42.35,33.4 42.35,32.22 ; 42.35,32.22 42.35,28.96 42.17,28.79 ; 42.35,32.22 42.42,32.14 v3(42.42,32.09)
  Inner2 w0.254: v3(21.21,45.8) 21.21,38.06 27.18,32.09 v3(42.42,32.09)
  Bottom Layer w0.254: R17.1 21.34,45.93 v3(21.21,45.8)
PWMD: length 31.4
  Top Layer w0.254: U9.32 42.85,34.45 v3(42.67,34.63)
  Inner2 w0.254: v3(42.67,34.63) 40.39,36.91 24.26,36.91 22.86,38.31 22.86,43.77 22.73,43.9 22.73,45.93 v3(22.86,46.06)
  Bottom Layer w0.254: v3(22.86,46.06) 22.99,46.19 R21.1
R2_2: length 11.2
  Top Layer w0.635: RP1.2 2.16,35.47 2.16,42.63 3.3,43.77 R2.2
R5_1: length 2
  Top Layer w0.508: R5.1 14.42,56.62 LED1.1
R7_1: length 1.6
  Top Layer w0.508: R7.1 27.93,9.09 5V_LED.1
R12_1: length 5.6
  Top Layer w0.508: LED4.1 19.94,11.35 v5(19.94,12.91)
  Bottom Layer w0.508: v5(19.94,12.91) 20.46,13.43 R12.1
RESET: length 28.7
  Top Layer w0.254: R16.2 61.31,44.79 v3(60.2,44.79) ; U9.7 41.85,44.34 41.66,44.53
  Top Layer w0.381: C16.2 61.32,46.37 R16.2 64.33,41.78 RESET.2
  Bottom Layer w0.254: v3(41.66,44.57) 41.87,44.79 v3(60.2,44.79)
SERVO_VCC: length 19.6
  Top Layer w0.508: R2.1 3.3,47.5 C2.2
  Top Layer w0.762: L1.1 10.62,53.64 9.82,54.44 4.16,54.44 C20.1 2.26,48.54 C2.2
SWCLK: length 18.8
  Top Layer w0.254: v3(50.04,35.14) 49.8,34.9 46.35,34.9
  Inner1 w0.254: v3(50.04,35.14) 63.12,35.14 SWDIO.2
SWDIO: length 22
  Top Layer w0.254: 43.85,33.4 43.85,34.28 44.2,34.63 v3(44.45,34.63)
  Inner1 w0.254: v3(44.45,34.63) 63.88,34.63 64.52,33.99
TRIG: length 23.4
  Top Layer w0.254: v3(44.96,38.31) 45.37,37.9 46.35,37.9
  Inner1 w0.254: v3(44.96,38.31) 45.85,39.2 45.85,47.2 44.45,48.6 41.66,48.6 41.15,49.11 41.15,53.72 CSB.2
U1_1: length 2.3
  Top Layer w0.508: U1.1 13.5,45.65 C3.1
U1_2: length 8.5
  Top Layer w0.508: U1.2 10.2,46.61 10.86,47.27 C3.2
  Top Layer w0.762: C3.2 13.72,50.9 L1.2
U1_3: length 13.4
  Top Layer w0.508: R4.2 8.93,46.52 8.93,46.35 ; 8.93,46.35 9.52,46.95 v3(9.52,47.96) ; 8.93,46.35 U1.3 ; R3.2 12.82,42.88 v3(12.57,42.88)
  Bottom Layer w0.508: v3(12.57,42.88) 12.57,46.82 11.43,47.96 v3(9.52,47.96)
U1_4: length 2.5
  Top Layer w0.508: C1.2 7.5,45.49 U1.4
U1_5: length 11.7
  Top Layer w0.635: U1.5 7.39,39.84 R1.2 5.21,32.78 RP1.3
U1_6: length 2.7
  Top Layer w0.635: U1.6 9.02,40.03 C7.1
U2_1: length 15.5
  Top Layer w0.889: 18.67,25.82 17.46,24.61 17.46,17.55 C8.1
  Top Layer w1.143: D1.1 12.56,15.71 C8.1
U3_3: length 8.5
  Top Layer w0.762: D2.1 10.16,7.07 10.92,7.83
  Top Layer w1.397: D2.1 10.16,4.51 R8.2
  Top Layer w2.286: U3.2 U3.3
U5_1: length 1.6
  Bottom Layer w0.508: R14.2 34.26,20.4 U5.1
U7_1: length 4.9
  Top Layer w0.254: U9.5 42.85,44.84 43.82,45.81 X1.1
U7_3: length 4.9
  Top Layer w0.254: 42.35,41.9 42.35,44.86 41.42,45.78 X1.3
U9_1: length 2.9
  Top Layer w0.254: 44.85,41.9 46.31,43.36 R20.2
USART2_RX: length 23.6
  Top Layer w0.254: U9.13 37.85,42.38 v3(38.73,43.26)
  Bottom Layer w0.254: v3(38.73,43.26) 38.73,52.15 40.39,53.81 47.35,53.81 48.64,55.1 USART2.2
  vias: v3(38.61,43.77)
USART2_TX: length 22.5
  Top Layer w0.254: 39.35,41.9 39.35,42.73 v3(39.75,43.14)
  Bottom Layer w0.254: v3(39.75,43.14) 39.75,47.84 41.15,49.23 41.15,51.65 42.42,52.92 49.28,52.92 51.18,54.82 51.18,55.46

## Copper pours and planes (outline as drawn; the poured copper is in the pictures)
3.3V on Top Layer: 33.15,33.1 35.43,33.1 35.43,28.02 35.31,27.9 32.37,27.9 32.25,28.01 32.25,32.21
3.3V on Bottom Layer: 33.66,31.49 33.7,31.45 35.31,31.45 35.31,28.99 35.27,28.95 33.68,28.95 33.66,28.97
5V on Bottom Layer: 27.31,14.05 32.13,14.05 32.51,14.44 33.12,14.56 33.27,14.44 33.27,13.7 31.51,12.02 27.3,12.02 27.3,14.05
5V on Bottom Layer: 27.33,15.71 27.33,14.05 33.27,14.05 32.5,15.71
5V on Inner1: 28.59,16.21 28.59,11.9 31.37,11.9 33.42,13.94 33.53,13.94 33.53,16.09 33.4,16.21 28.6,16.21
GND5V on Top Layer: 22.22,57.62 22.22,41.74 22.35,41.61 26.8,41.61 26.92,41.49 26.92,26.5 26.8,26.37 27.43,25.74 52.9,25.74 52.96,25.68 52.96,7.07 53.14,6.88 53.14,6.68 53.28,6.82 65.02,6.82 65.02,0.97 66.42,2.36 66.42,56.98 65.53,57.87 22.48,57.87
GND5V on Bottom Layer: 22.1,57.62 22.1,41.74 22.22,41.62 26.67,41.62 26.8,41.49 26.8,26.5 26.67,26.38 27.31,25.74 52.77,25.74 52.83,25.69 52.83,7.07 53.02,6.89 53.02,6.69 53.15,6.82 64.9,6.82 64.9,0.97 66.29,2.37 66.29,56.98 65.41,57.87 22.35,57.87
GND5V on Inner1: 22.1,57.49 22.1,41.62 22.22,41.49 26.67,41.49 26.8,41.36 26.8,26.38 26.67,26.25 27.31,25.62 52.77,25.62 52.83,25.56 52.83,6.95 53.02,6.76 53.02,6.56 53.15,6.69 64.9,6.69 64.9,0.84 66.29,2.24 66.29,56.86 65.41,57.75 22.35,57.75
GND5V on Inner2: 22.22,57.62 22.22,41.74 22.35,41.62 26.8,41.62 26.92,41.49 26.92,26.5 26.8,26.38 27.43,25.74 52.9,25.74 52.96,25.69 52.96,7.07 53.14,6.89 53.14,6.69 53.28,6.82 65.02,6.82 65.02,0.97 66.42,2.37 66.42,56.98 65.53,57.87 22.48,57.87
GNDVIN on Top Layer: 64.51,0.91 64.51,6.57 64.39,6.69 52.7,6.69 52.58,6.82 52.58,25.61 52.45,25.74 27.35,25.74 26.67,26.41 26.67,41.61 22.1,41.61 21.97,41.74 21.97,57.49 22.1,57.62 0.31,57.62 0.04,57.34 0.04,1.34 1.37,0.01 63.61,0.01
GNDVIN on Bottom Layer: 64.37,0.89 64.37,6.54 64.25,6.66 52.56,6.66 52.43,6.79 52.43,25.59 52.31,25.71 27.2,25.71 26.53,26.39 26.53,41.59 21.95,41.59 21.83,41.72 21.83,57.46 21.95,57.59 0.17,57.59 -0.11,57.32 -0.11,1.31 1.22,-0.02 63.47,-0.02
GNDVIN on Inner1: 64.62,0.89 64.62,6.54 64.5,6.66 52.82,6.66 52.69,6.79 52.69,25.59 52.56,25.71 27.46,25.71 26.78,26.39 26.78,41.59 22.21,41.59 22.08,41.72 22.08,57.46 22.21,57.59 0.42,57.59 0.15,57.32 0.15,1.31 1.48,-0.02 63.72,-0.02
GNDVIN on Inner2: 64.5,0.89 64.5,6.54 64.37,6.66 52.69,6.66 52.56,6.79 52.56,25.59 52.43,25.71 27.33,25.71 26.65,26.39 26.65,41.59 22.08,41.59 21.95,41.72 21.95,57.46 22.08,57.59 0.3,57.59 0.02,57.32 0.02,1.31 1.35,-0.02 63.59,-0.02
VIN on Top Layer: 6.73,10.88 3.17,15.07 3.05,23.83 3.68,24.21 4.44,24.34 4.95,24.6 5.33,24.85 5.59,25.1 5.71,25.48 5.71,25.87 5.59,26.25 5.33,26.5 4.83,26.75 0.13,26.75 0.25,8.85 5.71,8.85 6.48,9.23 6.73,9.74 6.86,10.12 6.86,10.88 6.73,11.01
VIN on Top Layer: 9.02,29.17 11.43,31.58 11.68,31.58 11.68,38.01 10.88,38.82 9.78,38.82 9.78,41.36 11.55,41.36 11.81,41.11 11.81,39.84 13.62,38.03 13.62,33.84 14.86,32.6 14.86,29.79 12.68,27.61 10.57,27.61
VIN on Top Layer: 0.38,26.63 2.67,29.29 12.32,29.29 12.83,28.79 12.83,21.93 12.06,21.93 11.94,22.06 10.81,22.06 7.43,25.43 1.96,25.43
VIN on Bottom Layer: 22.99,10.88 25.87,10.88 26.91,9.84 34.04,9.84 34.04,8.09 28.1,8.09 27.84,8.34 24.25,8.34
(no net) on Bottom Layer: 40.99,47.22 44.25,47.22 44.25,45.62 40.99,45.62
(no net) on Inner1: 40.99,47.22 44.25,47.22 44.25,45.62 40.99,45.62
(no net) on Inner2: 40.99,47.22 44.25,47.22 44.25,45.62 40.99,45.62
J1_2 on Top Layer: 0.25,2.62 0.76,2.12 0.76,1.74 1.52,0.97 1.91,0.97 2.54,0.34 3.17,0.34 3.56,-0.04 15.24,-0.04 15.49,0.21 15.49,3.26 8.13,3.26 8.13,8.21 8.89,8.97 10.41,8.97 11.05,9.74 11.05,11.01 9.65,11.01 7.49,8.85 6.48,7.58 0.38,7.58 0.25,7.45
R9_1 on Top Layer: 13.97,10.75 15.24,10.75 15.37,10.63 15.37,7.83 14.35,6.82 11.81,6.82 11.81,7.83 13.34,7.83 13.97,9.23
SERVO_VCC on Top Layer: 3.3,47.5 3.3,51.14 5.46,53.3 12.7,53.3 13.08,53.68 15.75,53.68 16.76,52.66 21.42,52.66 22.07,53.31 22.07,54.47 21.72,54.82 17.02,54.82 16.13,55.71 13.34,55.71 12.57,54.95 0.84,54.95 0.84,49.18 2.6,47.42 3.22,47.42
SERVO_VCC on Top Layer: 9.4,53.42 9.91,52.92 11.51,52.92 12.02,53.42
U3_3 on Top Layer: 10.8,3.77 10.8,7.2 12.7,9.1 13.21,9.1 13.34,9.23 13.34,10.88 11.43,12.66 11.3,12.78 10.54,13.42 10.29,13.67 9.14,14.69 9.02,14.82 8,15.71 6.55,17.16 6.22,17.36 4.52,17.36 3.56,16.85 3.56,15.86 5.46,15.32 6.1,14.94 6.35,14.69 7.24,14.05 7.49,13.8 8.64,13.04 9.65,12.28 10.16,12.02 11.43,11.01 11.81,10.63 11.81,9.23 11.18,8.59 10.41,8.21 10.03,7.83 9.91,7.58 9.65,7.32 9.65,5.29 9.4,5.04 9.4,3.89 9.27,3.77

## Text on the board
Top Silkscreen Layer: 3.3V_LED | DJ_LED | G | M1- | 0R | 5V | PWMA | VIM | ECHO | 3.3V | TRIG | TX | SCL | RX | SDA | DRV8848 | BOOT0 | PB5 | PA12 | PA15 | BOOT1 | PB4 | PB3 | 3.3 | DIO | M2+ | CLK
